# EAGLE design room_controller3 (EAGLE 7.5.0)
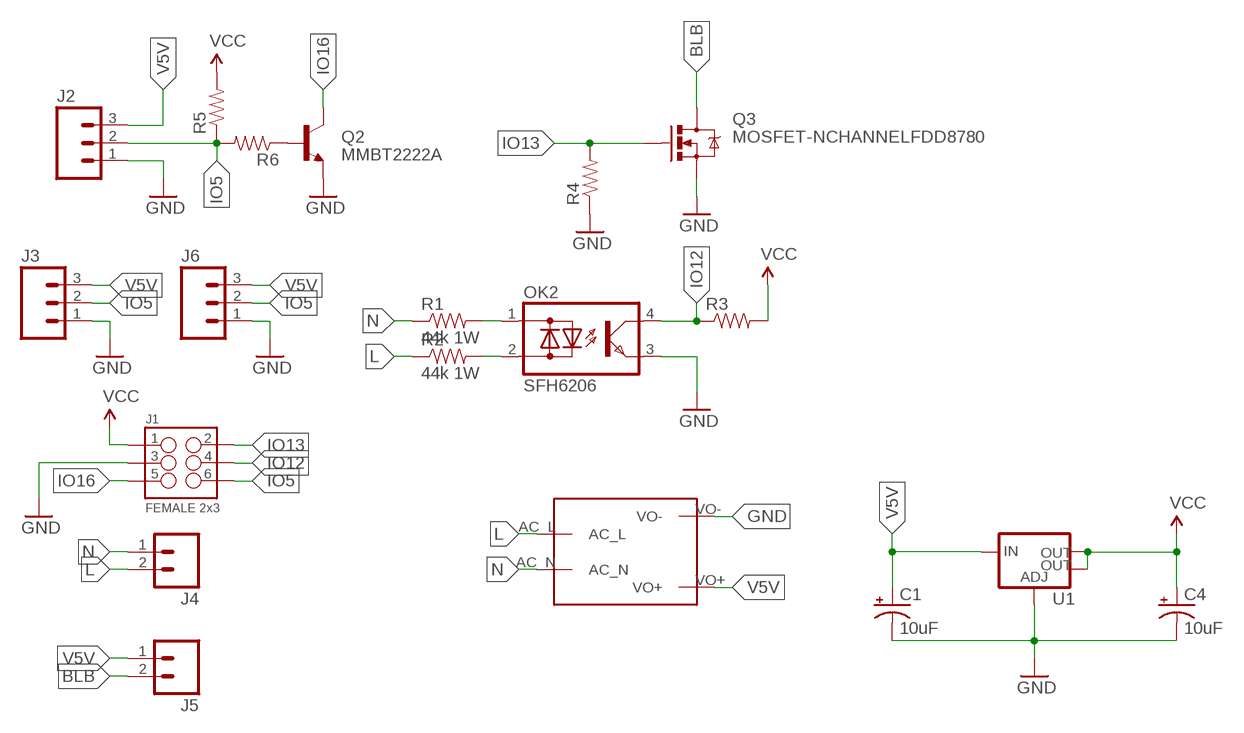
[diagram p0: schematic, sheet 1]

## Parts
C1  10uF  CAP_POL1206-KIT  [EIA3216-KIT]
C4  10uF  CAP_POL1206-KIT  [EIA3216-KIT]
J1  FEMALE 2x3  M03X2SHROUD  [2X3-SHROUDED]
J2  M03PTH  [1X03]
J3  M03PTH  [1X03]
J4  M025MM  [SCREWTERMINAL-5MM-2]
J5  M025MM  [SCREWTERMINAL-5MM-2]
J6  M03PTH  [1X03]
OK2  SFH6206  [DIL4-SMD]
Q2  MMBT2222A  TRANSISTOR_NPNMMBT2222A  [SOT23-3]
Q3  MOSFET-NCHANNELFDD8780  [DPAK]
R1  44k 1W  RESISTORPTH-1/4W  [AXIAL-0.4]
R2  44k 1W  RESISTORPTH-1/4W  [AXIAL-0.4]
R3  RESISTOR0805-RES  [0805]
R4  RESISTOR0805-RES  [0805]
R5  RESISTOR0805-RES  [0805]
R6  RESISTOR0805-RES  [0805]
U1  V_REG_LM1117SOT223  [SOT223]
U$1  MAINS_CONVERTERS  [HLK-PM01]

## Nets
BLB: J5.2 Q3.4(D)
GND: C1.C(-) C4.C(-) J1.3 J2.1 J3.1 J6.1 OK2.3(E) Q2.2(E) Q3.3(S) R4.1 U1.1(ADJ) U$1.VO-
IO5: J1.6 J2.2 J3.2 J6.2 R5.1 R6.2
IO12: J1.4 OK2.4(C) R3.1
IO13: J1.2 Q3.1(G) R4.2
IO16: J1.5 Q2.3(C)
L: J4.2 R2.P$1 U$1.AC_L
N: J4.1 R1.P$1 U$1.AC_N
N$1: OK2.1(AC1) R1.P$2
N$2: OK2.2(AC2) R2.P$2
N$5: Q2.1(B) R6.1
V5V: C1.A(+) J2.3 J3.3 J5.1 J6.3 U1.3(IN) U$1.VO+
VCC: C4.A(+) J1.1 R3.2 R5.2 U1.2(OUT) U1.4(OUT)

## Library data of the parts
C1 C4 = SparkFun-Capacitors:CAP_POL: Capacitor Polarized These are standard SMD and PTH capacitors. Normally 10uF, 47uF, and 100uF in electrolytic and tantalum varieties. Always verify the external diameter of the through hole cap, it varies with capacity, voltage, and manufacturer. The EIA devices should be standard.
J1 = SparkFun-Connectors:M03X2: 2x3 .1" header. Shrouded, with keying- CONN-10681 SMT- CONN-11415 Pogo pins- HW-11044; PROD_ID: CONN-10681
J2 J3 J6 = SparkFun-Connectors:M03: Header 3 Standard 3-pin 0.1" header. Use with straight break away headers (SKU : PRT-00116), right angle break away headers (PRT-00553), swiss pins (PRT-00743), machine pins (PRT-00117), and female headers (PRT-00115). Molex polarized connector foot print use with SKU : PRT-08232 with associated crimp pins and housings.
J4 J5 = SparkFun-Connectors:M02: Standard 2-pin 0.1" header. Use with - straight break away headers ( PRT-00116) - right angle break away headers (PRT-00553) - swiss pins (PRT-00743) - machine pins (PRT-00117) - female headers (PRT-00115) Molex polarized connector foot print use with: PRT-08233 with associated crimp pins and housings. 2.54_SCREWTERM for use with PRT-10571. 3.5mm Screw Terminal footprints for PRT-08084 5mm Screw Terminal footprints for use with PRT-08432; STOREFRONT_ID: PRT-08432
OK2 = optodevices:SFH620: Optocoupler, Phototransistor Output, AC Input Source: http://www.vishay.com/docs/83675/sfh620.pdf
Q2 = SparkFun-DiscreteSemi:TRANSISTOR_NPN: Generic NPN BJT MMBT2222A - TRANS-08049 (SOT-23, 1A 40V) MPSA42 - TRANS-09116 (SOT-23, 500mA 300V) MMBT5088LT1G - TRANS-11160 (SOT-23, 50 mA 30V) BC547 - COM-08928 <http://www.sparkfun.com/products/8928> (TO-92 45V 100mA) (1.Collector 2.Base 3.Emitter) 2N3904 - COM-00521 <http://www.sparkfun.com/products/521> (TO-92 40V 200mA) (1.Emitter 2.Base 3.Collector) P2N2222A - COM-12852 <http://www.sparkfun.com/products/12852> (TO-92 40V 600mA) (1.Collector 2.Base 3.Emitter); PROD_ID: TRANS-08049
Q3 = SparkFun-DiscreteSemi:MOSFET-NCHANNEL: Common NMOSFET Parts MFG P/N Store ID Prod ID FDD8780 TRANS-09984 SI7820DN TRANS-11055 FDS6630A IC-08089 2N7002PW TRANS-11151 FQP30N06L COM-10213 TRANS-10060 BSS123LT1G TRANS-08345 BSS138 TRANS-00830 BS170 2N7000; PROD_ID: TRANS-09984
R1 R2 = SparkFun-Resistors:RESISTOR: Resistor Basic schematic elements and footprints for 0603, 1206, and PTH resistors.
R3-R6 = SparkFun-Passives:RESISTOR: Resistor Basic schematic elements and footprints for 0603, 1206, and PTH resistors.
U1 = SparkFun-PowerIC:V_REG_LM1117: Voltage Regulator LM1117 Standard adjustable voltage regulator but in SMD form. Spark Fun Electronics SKU : COM-00595; PROD_ID: VREG-08170
U$1 = captain-slow:MAINS_CONVERTERS

## Board
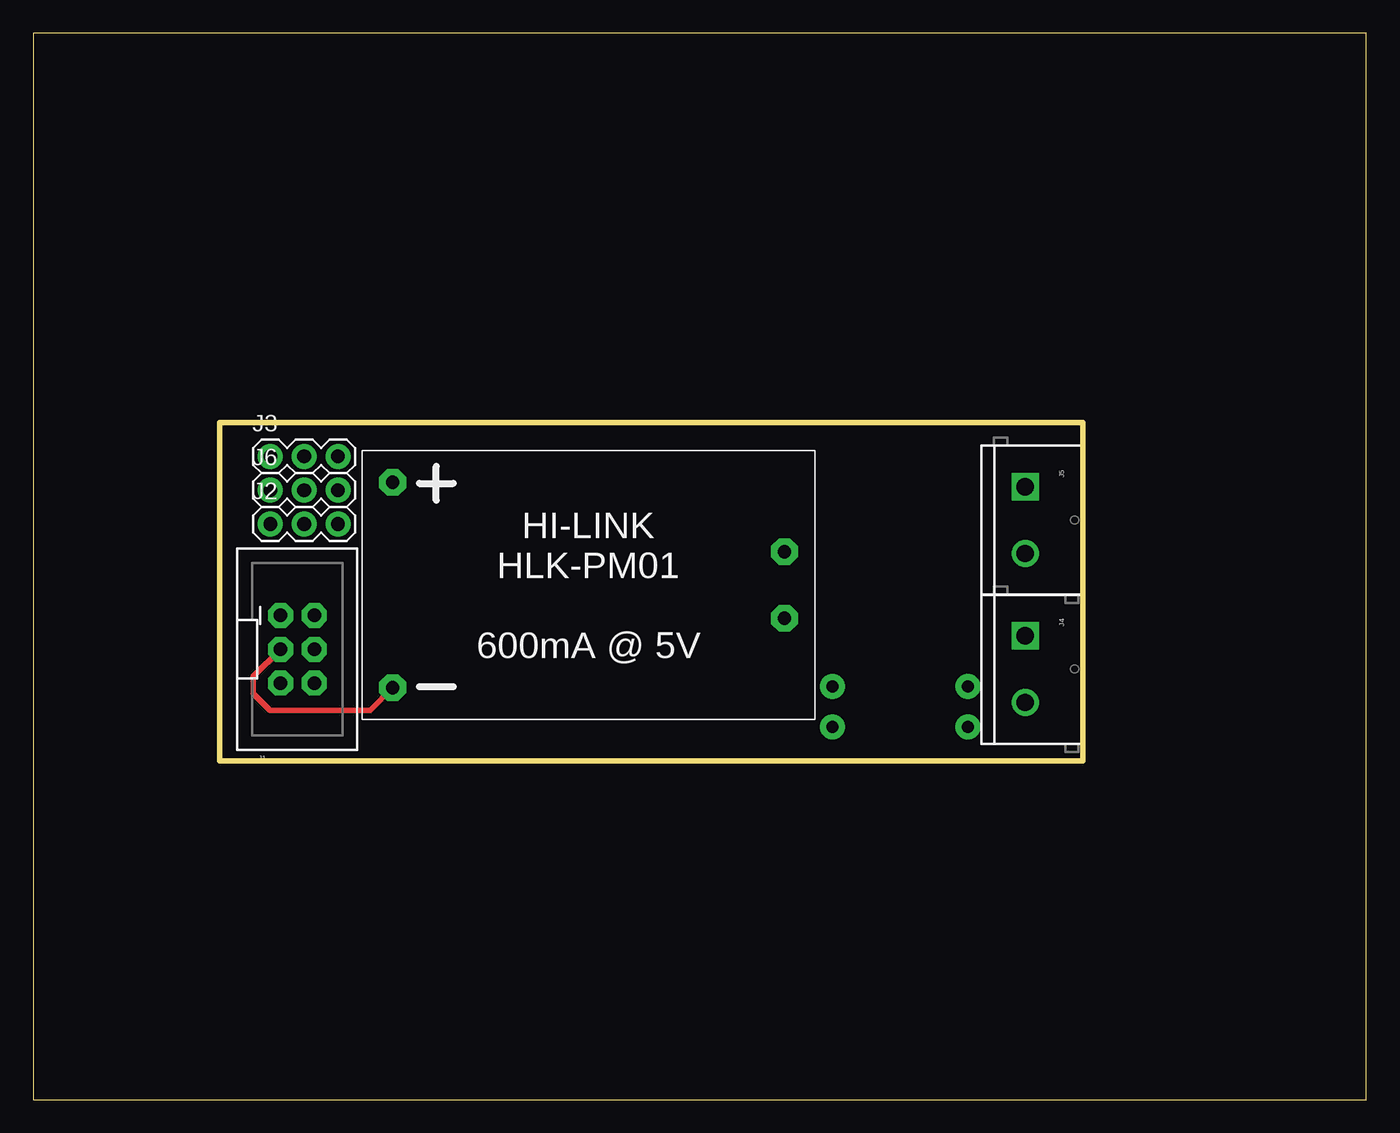
[diagram p1: board, top side]
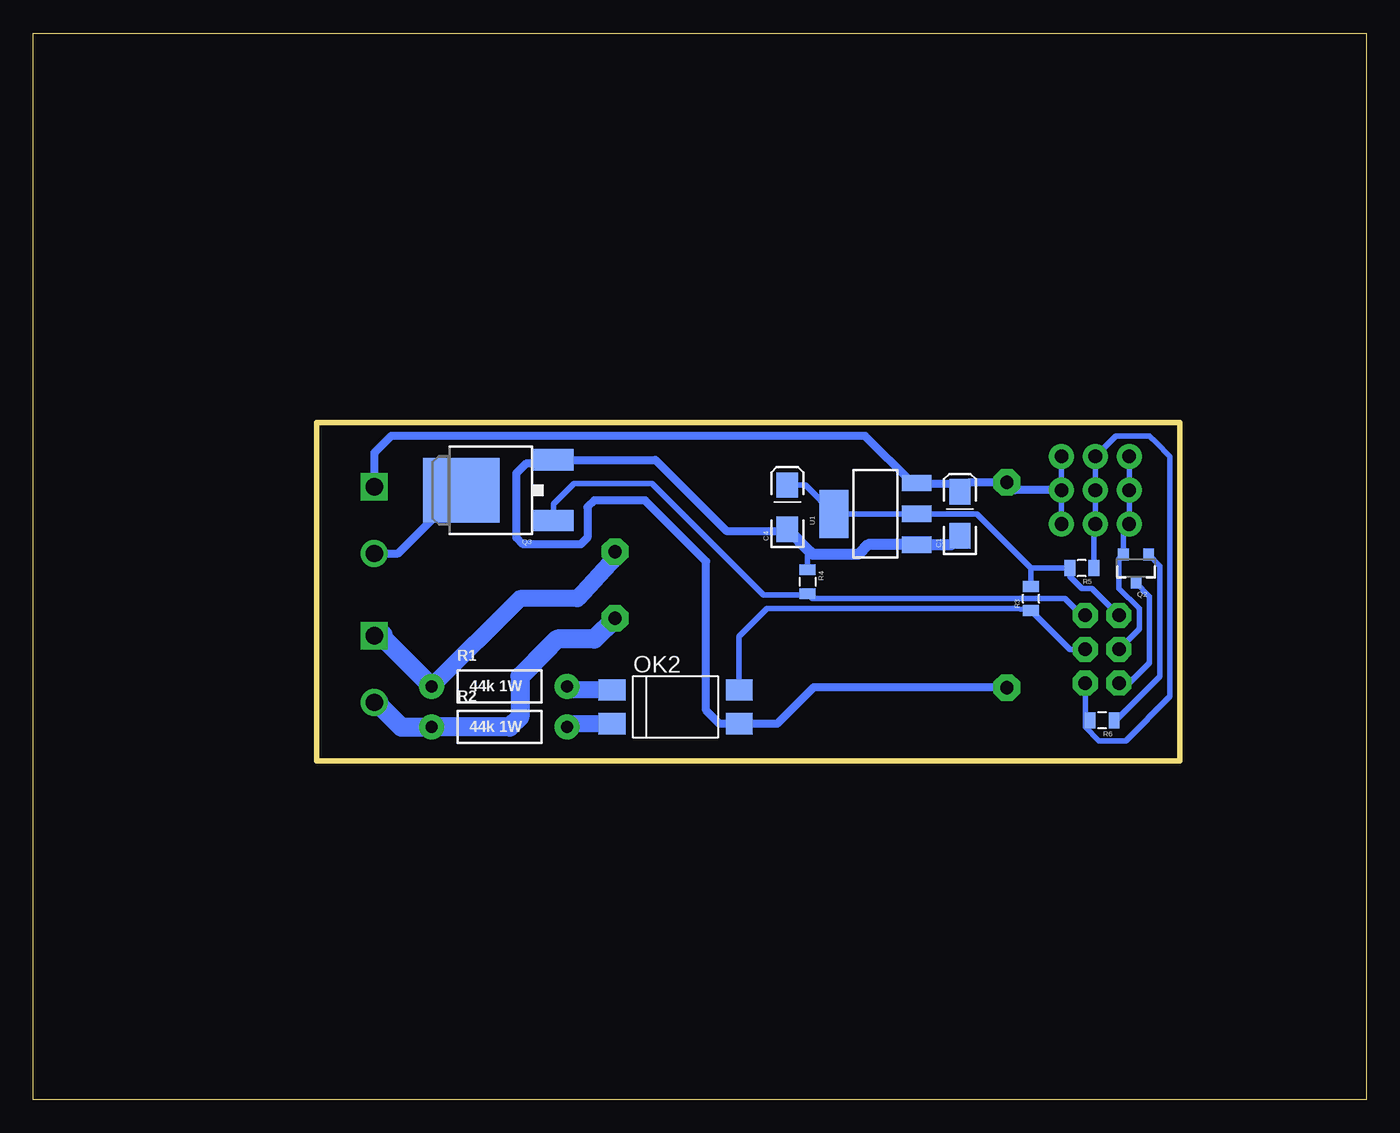
[diagram p2: board, bottom side, seen from below]

Size 100 x 80 mm. Coordinates in mm from the lower left corner, seen from the top.
Outline: 0,0 100,0 100,80 0,80 0,0
Outline: 78.74,50.8 78.74,25.4 13.97,25.4 13.97,50.8 78.74,50.8
Copper layers (1*16): Top 0.035mm / dielectric 1.5mm / Bottom 0.035mm
Design rules "default": minimum track width 10mil, minimum drill 24mil, track to track 8mil, track to pad 8mil, pad to pad 8mil, via to via 8mil, smd to smd 8mil, copper to edge 40mil, drill to drill 8mil, minimum pad ring 10mil, minimum via ring 8mil, stop-mask expansion 4mil, vias tented up to drill 0mil, thermal gap 10mil

### Footprints (pad centres in the part's own frame; a part is rotated, then mirrored left to right if it is on the bottom)
EIA3216-KIT = smd 1.9 x 1.6: A 1.65,0; C -1.65,0
2X3-SHROUDED = drill 1.016 pad 1.88 octagon: 1 -1.27,2.54; 2 1.27,2.54; 3 -1.27,0; 4 1.27,0; 5 -1.27,-2.54; 6 1.27,-2.54
1X03 = drill 1.016 pad 1.88: 1 0,0; 2 2.54,0; 3 5.08,0
SCREWTERMINAL-5MM-2 = drill 1.3 pad 2.032 square: 1 0,0 | drill 1.3 pad 2.032: 2 5,0
DIL4-SMD = smd 1.6 x 2: 1 -1.27,-4.77; 2 1.27,-4.77; 3 1.27,4.77; 4 -1.27,4.77
SOT23-3 = smd 0.8 x 0.9: 1 -0.95,-1; 2 0.95,-1; 3 0,1.1
DPAK = smd 1.6 x 3: 1 -2.28,-5.31; 3 2.28,-5.31 | smd 4.826 x 5.715: 4 0,1.588
AXIAL-0.4 = drill 0.9 pad 1.88: P$1 -5.08,0; P$2 5.08,0
0805 = smd 0.8 x 1.2: 1 -0.9,0; 2 0.9,0
SOT223 = smd 1.219 x 2.235: 1 -2.311,-3.099; 2 0,-3.099; 3 2.311,-3.099 | smd 3.6 x 2.2: 4 0,3.099
HLK-PM01 = drill 1 pad 2 octagon: AC_L -14.7,2.5; AC_N -14.7,-2.5; VO+ 14.7,-7.7; VO- 14.7,7.7

### Placement (x,y rotation side)
C1  30.48,43.94 90 bottom
C4  43.43,44.45 90 bottom
J1  19.81,33.78 0 top
J2  17.78,43.18 0 top
J3  17.78,48.26 0 top
J4  74.42,34.8 270 top
J5  74.42,45.97 270 top
J6  17.78,45.72 0 top
OK2  51.82,29.46 270 bottom
Q2  17.27,39.88 180 bottom
Q3  66.29,45.72 90 bottom
R1  65.02,30.99 0 bottom
R2  65.02,27.94 0 bottom
R3  25.15,37.59 90 bottom
R4  41.91,38.86 270 bottom
R5  21.34,39.88 180 bottom
R6  19.81,28.45 180 bottom
U1  36.83,43.94 90 bottom
U$1  41.66,38.61 180 top

### Tracks (layer width: path | path; a pad name or v marks a point on that pad's centre or on a via)
BLB
  Bottom 0.61: J5.2 72.63,40.97 Q3.4
GND
  Top 0.406: J1.3 16.51,31.75 16.51,30.48 17.78,29.21 25.26,29.21 U$1.VO-
  Bottom 0.406: 31.14,41.63 C1.C | 26.98,30.93 U$1.VO- | J3.1 J6.1 J2.1 18.22,42.74 Q2.2 18.54,40.56 18.54,38.35 17.02,36.83 17.02,35.31 J1.3 | R4.1 41.91,40.89 41.72,41.09 | 43.56,42.67 C4.C | 61.23,47.75 Q3.3
  Bottom 0.61: 26.98,30.93 41.46,30.93 44.2,28.19 OK2.3 48.51,28.19 49.53,29.21 49.53,40.39 54.1,44.96 57.91,44.96 58.42,44.45 58.42,42.16 58.93,41.66 63.25,41.66 63.75,42.16 63.75,46.99 62.99,47.75 61.23,47.75 | Q3.3 53.33,48 48.01,42.67 43.56,42.67
  Bottom 0.813: 31.14,41.63 U1.1 37.36,41.63 38.1,40.89 41.53,40.89 41.72,41.09 C4.C
IO5
  Bottom 0.406: R5.1 20.44,43.06 J2.2 J6.2 J3.2 18.8,49.78 16.26,49.78 15.75,49.28 14.73,48.26 14.73,30.23 18.03,26.92 20.07,26.92 21.08,27.94 J1.6 21.08,28.82 R6.2
IO12
  Bottom 0.406: OK2.4 47.05,34.74 44.96,36.83 26.28,36.83 R3.1 22.24,33.78 J1.4
IO13
  Bottom 0.406: J1.2 21.34,36.32 22.61,37.59 41.54,37.59 R4.2 42.03,37.85 45.21,37.85 53.59,46.23 59.44,46.23 60.98,44.68 Q3.1
IO16
  Bottom 0.406: J1.5 17.78,31.24 16.26,32.77 16.26,37.76 Q2.3
L
  Bottom 1.422: U$1.AC_L 57.92,34.54 60.71,34.54 61.21,34.04 63.5,31.75 63.5,28.7 64.26,27.94 R2.P$1 72.39,27.94 74.25,29.8
  Bottom 1.778: J4.2 74.25,29.8
N
  Bottom 0.813: U$1.AC_N 56.36,40.67
  Bottom 1.27: 56.36,40.67 59.18,37.59 63.5,37.59 R1.P$1
  Bottom 1.422: 73.91,34.8 R1.P$1
  Bottom 1.778: J4.1 73.91,34.8
N$1
  Bottom 1.27: OK2.1 59.69,30.73 R1.P$2
N$2
  Bottom 1.27: OK2.2 59.69,28.19 R2.P$2
N$5
  Bottom 0.406: R6.1 18.8,28.45 15.49,31.75 15.49,40.05 Q2.1
V5V
  Bottom 0.406: 33.45,46.23 U1.3 | J3.3 J6.3 J2.3
  Bottom 0.61: 33.45,46.23 31.12,46.23 C1.A 29.76,46.31 U$1.VO+ 26.37,45.72 J6.3 | 34.06,46.25 37.59,49.78 73.15,49.78 74.42,48.51 J5.1
  Bottom 0.813: U1.3 34.06,46.25
VCC
  Bottom 0.406: C4.A 42.09,46.1 U1.4 U1.2 29.21,43.94 25.15,39.88 | 25.15,39.88 R3.2 | 25.15,39.88 R5.2 22.24,39.25 21.34,38.35 20.57,38.35 J1.1